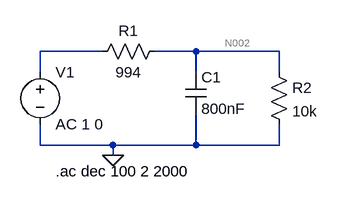
[diagram p0: schematic Low pass filter load.asc]
Low pass filter load.asc, the LTspice schematic file:
Version 4
SHEET 1 880 680
WIRE 192 112 96 112
WIRE 336 112 272 112
WIRE 464 112 336 112
WIRE 96 144 96 112
WIRE 336 144 336 112
WIRE 464 144 464 112
WIRE 96 256 96 224
WIRE 208 256 96 256
WIRE 336 256 336 208
WIRE 336 256 208 256
WIRE 464 256 464 224
WIRE 464 256 336 256
WIRE 208 272 208 256
FLAG 208 272 0
SYMBOL voltage 96 128 R0
SYMATTR InstName V1
SYMATTR Value AC 1 0
SYMBOL res 288 96 R90
WINDOW 0 0 56 VBottom 2
WINDOW 3 32 56 VTop 2
SYMATTR InstName R1
SYMATTR Value 994
SYMBOL cap 320 144 R0
SYMATTR InstName C1
SYMATTR Value 800nF
SYMBOL res 448 128 R0
SYMATTR InstName R2
SYMATTR Value 10k
TEXT 120 296 Left 2 !.ac dec 100 2 2000

The netlist it stands for:
* Low pass filter load.asc
V1 N001 0 AC 1 0
R1 N002 N001 994
C1 N002 0 800nF
R2 N002 0 10k
.ac dec 100 2 2000
.backanno
.end

* Results of the author's LTspice run, read from the files saved beside the schematic
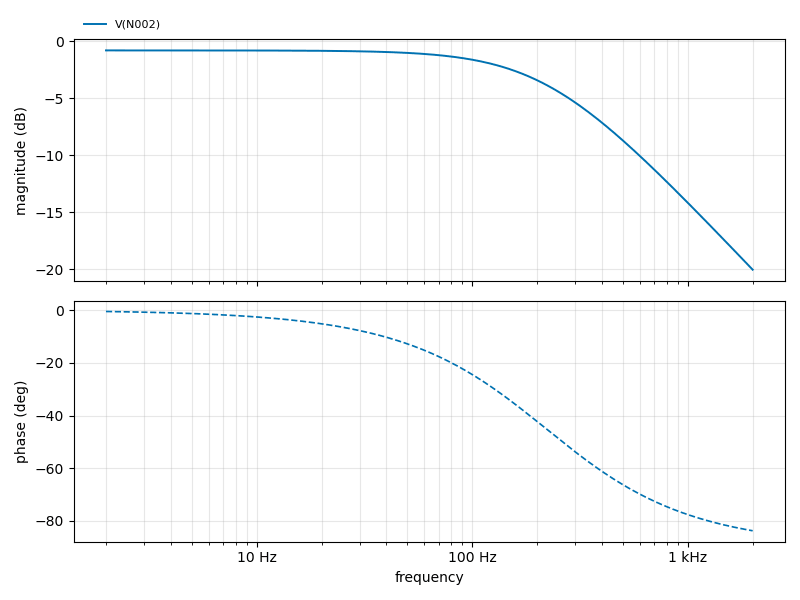
[diagram p1: AC Analysis of Low pass filter load.asc, plotted from the saved traces]
* AC Analysis, 1 run:
*   V(N002): -0.82 dB at 2 Hz, -20.05 dB at 2 kHz, peak -0.82 dB at 2 Hz, 3 dB below the peak at 220 Hz